# Altium schematic sheet Arduino_Shield_2.SchDoc: Arduino_Shield_2
size A4; Organization: University of Colorado; Address1: Boulder; DocumentNumber: 2; Revision: 0; SheetNumber: 2; SheetTotal: 2
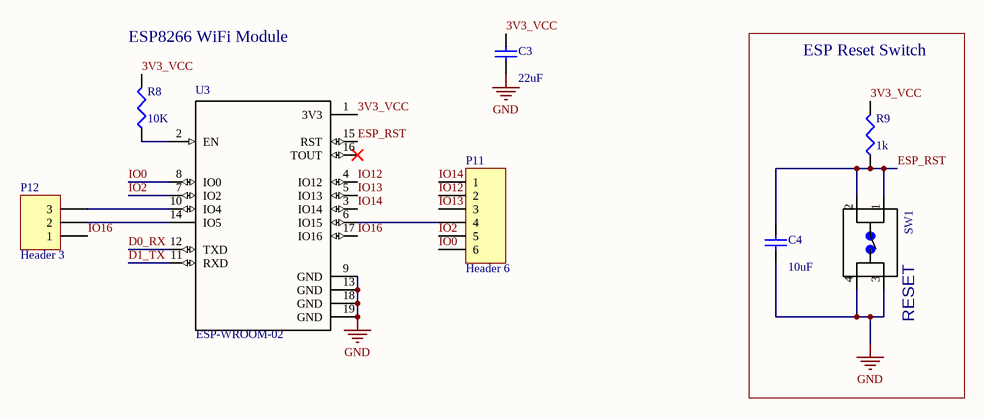
[diagram p0: Arduino_Shield_2.SchDoc]

## Parts
C3  value 22uF  [C1206]  (hidden comment: Cap Semi)
C4  value 10uF  [C1206]  (hidden comment: Cap Semi)
P11  Header 6  [HDR1X6]
P12  Header 3  [HDR1X3]
R8  value 10K  [C1206]  (hidden comment: Res3)
R9  value 1k  [C1206]  (hidden comment: Res3)
SW1  RESET  [*TE_FSM4JSMA]
U3  ESP-WROOM-02  [*MODULE_ESP-WROOM-02]

## Blocks framed on the sheet
ESP Reset Switch: C4 R9 SW1

## Nets
GND: C3.1 C4.1 SW1.3 SW1.4 U3.9(GND) U3.13(GND) U3.18(GND) U3.19(GND)
3V3_VCC: C3.2 R8.2 R9.2 U3.1(3V3)
D0_RX: U3.12(TXD)
D1_TX: U3.11(RXD)
ESP_RST: C4.2 R9.1 SW1.1 SW1.2 U3.15(RST)
IO0: P11.6 U3.8(IO0)
IO2: P11.5 U3.7(IO2)
IO12: P11.2 U3.4(IO12)
IO13: P11.3 U3.5(IO13)
IO14: P11.1 U3.3(IO14)
IO16: P12.1 U3.17(IO16)
NetP11_4: P11.4 U3.6(IO15)
NetP12_2: P12.2 U3.14(IO5)
NetP12_3: P12.3 U3.10(IO4)
NetR8_1: R8.1 U3.2(EN)

Not connected (* = marked no-connect by the designer): U3 16(TOUT)*

## Notes on the sheet
- (near R8) ESP8266 WiFi Module
- Title
- Size:
- Date:
- A4
- Number:
- Time:
- Revision:
- Sheet
- of
- File:

## Library data of the parts
C3 C4 = Cap Semi: Capacitor (Semiconductor SIM Model); Published: 8-Jun-2000; LatestRevisionDate: 29-May-2009; LatestRevisionNote: IPC-7351 Footprint Added.; PackageReference: C1206; Publisher: Altium Limited; PackageDescription: Chip Capacitor; DigiKeyPartNo: 1276-1079-1-ND
P11 = Header 6: Header, 6-Pin; LatestRevisionDate: 17-Jul-2002; LatestRevisionNote: Re-released for DXP Platform.; Publisher: Altium Limited; DigiKeyPartNo: 1212-1179-ND
P12 = Header 3: Header, 3-Pin; LatestRevisionDate: 17-Jul-2002; LatestRevisionNote: Re-released for DXP Platform.; Publisher: Altium Limited; DigiKeyPartNo: 1212-1179-ND
R8 R9 = Res3: Resistor; Published: 8-Jun-2000; LatestRevisionDate: 29-May-2009; LatestRevisionNote: IPC-7351 Footprint Added.; Publisher: Altium Limited; PackageDescription: Chip Resistor
  R8: PackageReference: J1-0603; DigiKeyPartNo: RMCF1206JT10K0CT-ND
  R9: PackageReference: 1206; DigiKeyPartNo: RNCP1206FTD1K00CT-ND
SW1 = FSM4JSMA: FSM4JSMA=SMT,TACTILE,PB SWITCH; MF: TE Connectivity; Package: None; EU_RoHS_Compliance: Compliant; TE_purchase_URL: https://www.te.com/usa-en/product-4-1437565-1.html?te_bu=Cor&te_type=disp&te_campaign=seda_glo_cor-seda-global-disp-prtnr-fy19-seda-model-bom-cta_sma-317_1&elqCampaignId=32493; MP: FSM4JSMA; Price: None; SnapEDA_Link: https://www.snapeda.com/parts/FSM4JSMA/TE%20Connectivity%20ALCOSWITCH%20Switches/view-part/?ref=snap; Availability: Unavailable; Value: *; DigiKeyPartNo: 450-1759-1-ND
U3 = ESP-WROOM-02: Wi-Fi Module w/ESP8266 802.11b/g/n 20dBm 20x18x3mm; MF: Espressif Systems; SnapEDA_Link: https://www.snapeda.com/parts/ESP-WROOM-02/Espressif%20Systems/view-part/?ref=snap; MP: ESP-WROOM-02; Availability: Unavailable; Price: None; Package: SMD-18 Espressif Systems; Value: *; DigiKeyPartNo: 1904-1021-1-ND